# EAGLE design Audio-4 (EAGLE 7.2.0)
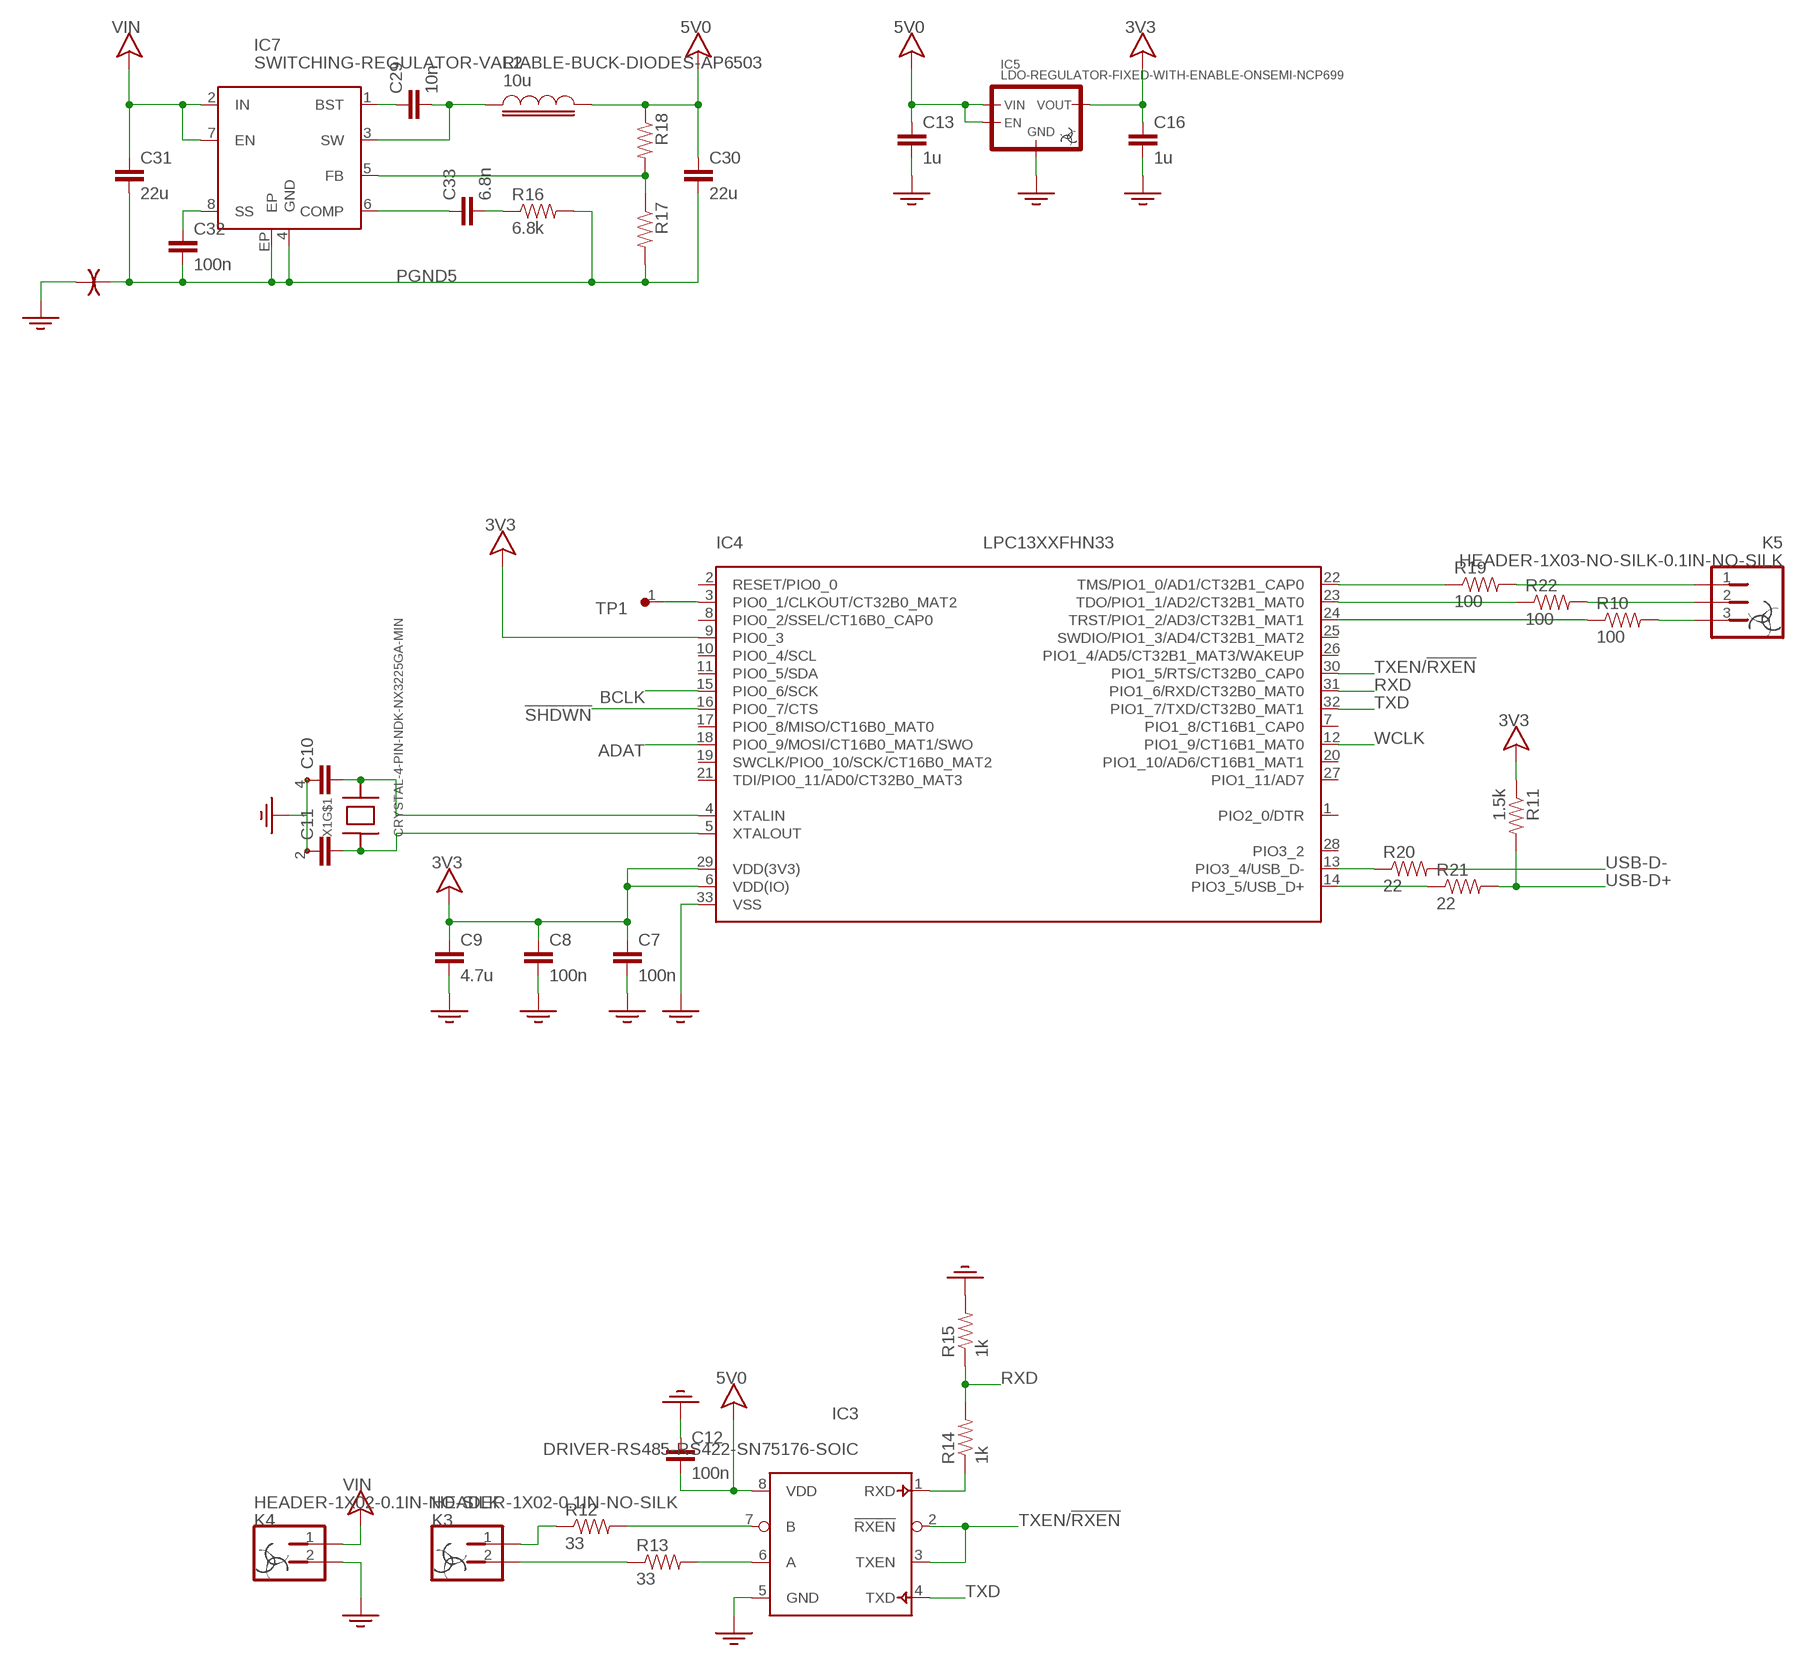
[diagram p0: schematic, sheet 1, part 1 of 2]
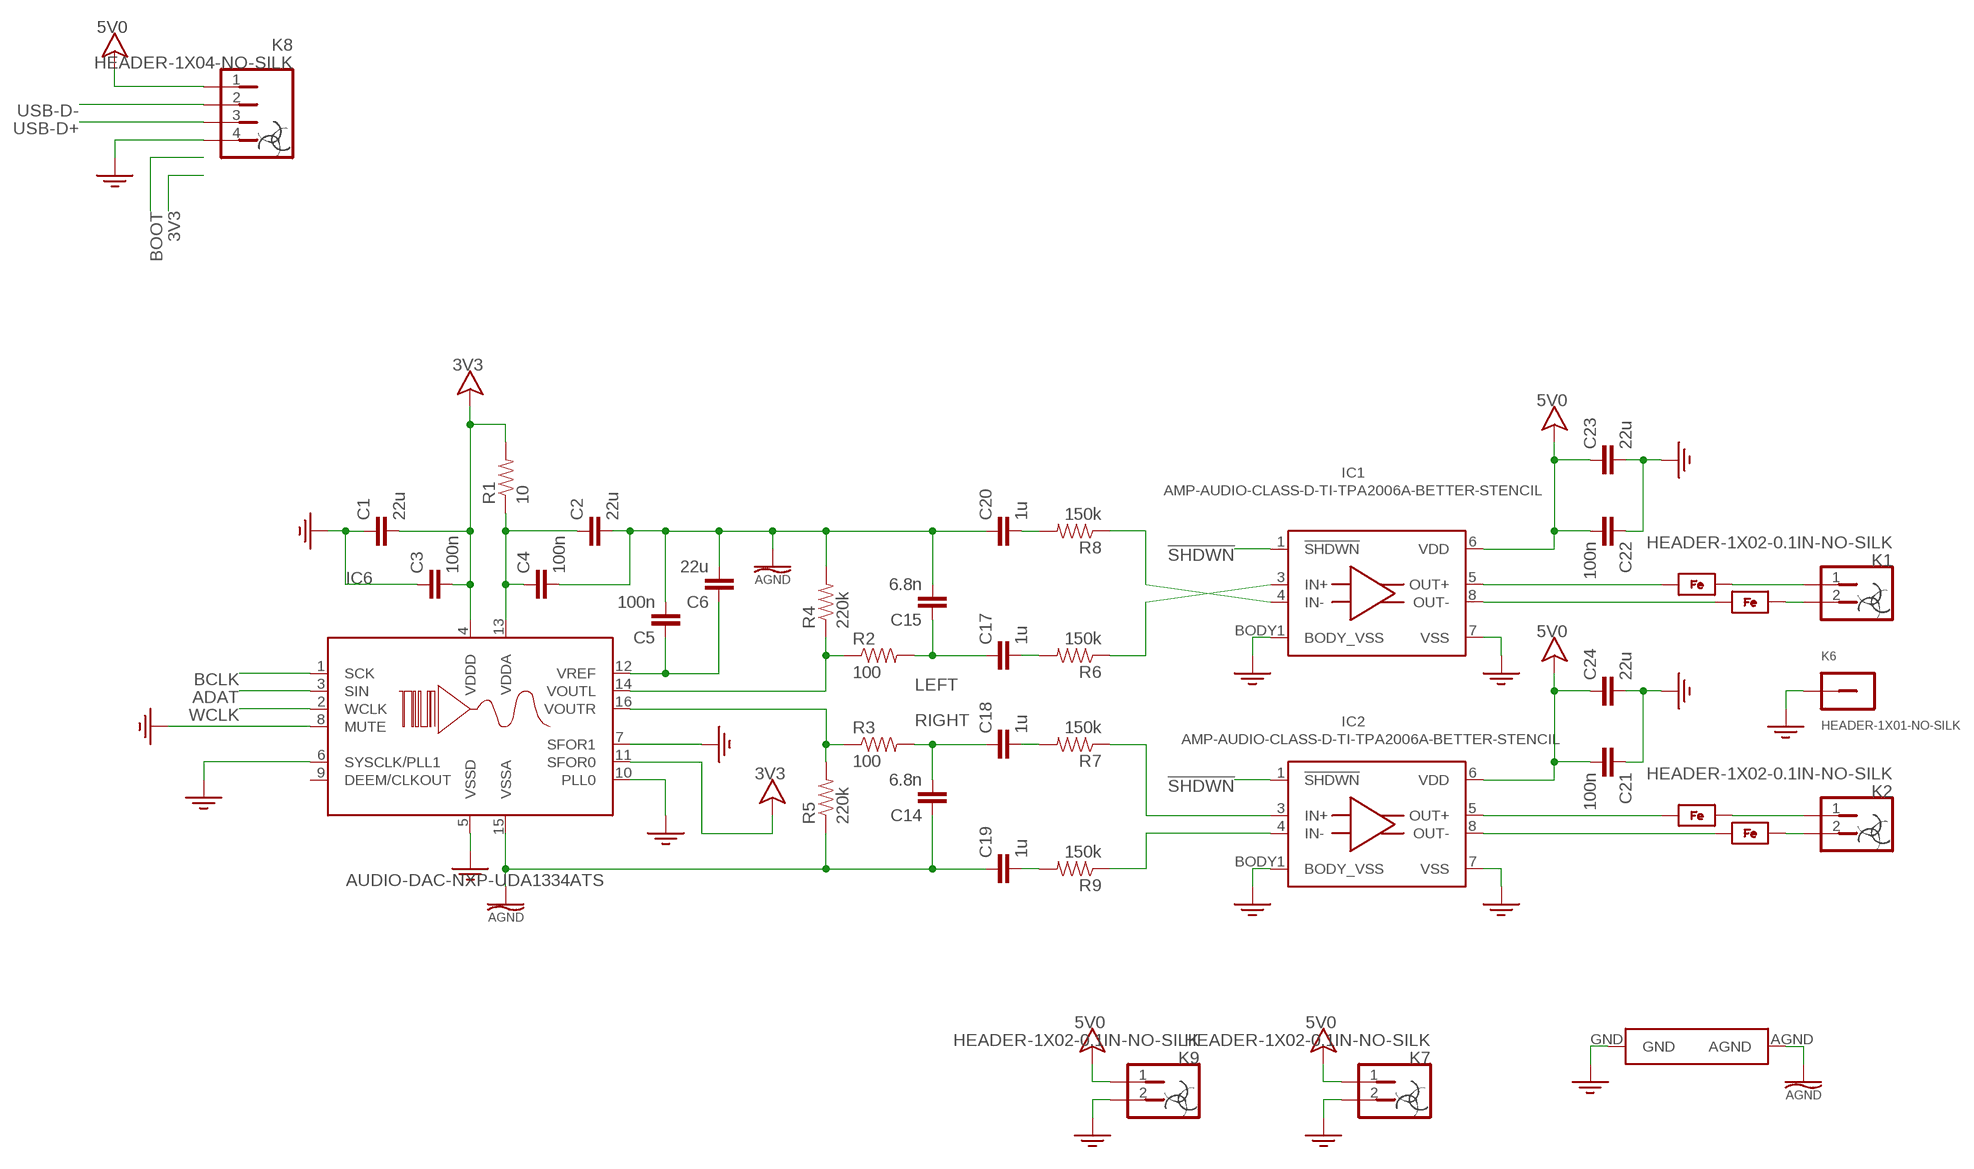
[diagram p1: schematic, sheet 1, part 2 of 2]

## Parts
C1  22u  CAP-1206-MIN  [1206-MIN]
C2  22u  CAP-1206-MIN  [1206-MIN]
C3  100n  CAP-0603-MIN  [0603-MIN]
C4  100n  CAP-0603-MIN  [0603-MIN]
C5  100n  CAP-0603-MIN  [0603-MIN]
C6  22u  CAP-1206-MIN  [1206-MIN]
C7  100n  CAP-0603-MIN  [0603-MIN]
C8  100n  CAP-0603-MIN  [0603-MIN]
C9  4.7u  CAP-0603-MIN  [0603-MIN]
C10  CAP-0603-MIN  [0603-MIN]
C11  CAP-0603-MIN  [0603-MIN]
C12  100n  CAP-0603-MIN  [0603-MIN]
C13  1u  CAP-0603-MIN  [0603-MIN]
C14  6.8n  CAP-0603-MIN  [0603-MIN]
C15  6.8n  CAP-0603-MIN  [0603-MIN]
C16  1u  CAP-0603-MIN  [0603-MIN]
C17  1u  CAP-0603-MIN  [0603-MIN]
C18  1u  CAP-0603-MIN  [0603-MIN]
C19  1u  CAP-0603-MIN  [0603-MIN]
C20  1u  CAP-0603-MIN  [0603-MIN]
C21  100n  CAP-0603-MIN  [0603-MIN]
C22  100n  CAP-0603-MIN  [0603-MIN]
C23  22u  CAP-1206-MIN  [1206-MIN]
C24  22u  CAP-1206-MIN  [1206-MIN]
C29  10n  CAP-0603-MIN  [0603-MIN]
C30  22u  CAP-1206  [1206]
C31  22u  CAP-1206  [1206]
C32  100n  CAP-0603-MIN  [0603-MIN]
C33  6.8n  CAP-0603-MIN  [0603-MIN]
FB1  FERRITE-BEAD-0603-MIN  [0603-MIN]
FB2  FERRITE-BEAD-0603-MIN  [0603-MIN]
FB3  FERRITE-BEAD-0603-MIN  [0603-MIN]
FB4  FERRITE-BEAD-0603-MIN  [0603-MIN]
IC1  AMP-AUDIO-CLASS-D-TI-TPA2006A-BETTER-STENCIL  [QFN8-3X3MM-TI-TPA200X-BETTER-STENCIL]
IC2  AMP-AUDIO-CLASS-D-TI-TPA2006A-BETTER-STENCIL  [QFN8-3X3MM-TI-TPA200X-BETTER-STENCIL]
IC3  DRIVER-RS485-RS422-SN75176-SOIC  [EIAJ-SOIC8]
IC4  LPC13XXFHN33  [HVQFN33-7X7MM]
IC5  LDO-REGULATOR-FIXED-WITH-ENABLE-ONSEMI-NCP699  [SOT23-5]
IC6  AUDIO-DAC-NXP-UDA1334ATS  [TSSOP16]
IC7  SWITCHING-REGULATOR-VARIABLE-BUCK-DIODES-AP6503  [EIAJ-SOIC8-3.9MM-EXPOSED-PAD]
K1  HEADER-1X02-0.1IN-NO-SILK  [HEADER-1X02-NO-SILK]
K2  HEADER-1X02-0.1IN-NO-SILK  [HEADER-1X02-NO-SILK]
K3  HEADER-1X02-0.1IN-NO-SILK  [HEADER-1X02-NO-SILK]
K4  HEADER-1X02-0.1IN-NO-SILK  [HEADER-1X02-NO-SILK]
K5  HEADER-1X03-NO-SILK-0.1IN-NO-SILK  [HEADER-1X03-NO-SILK]
K6  HEADER-1X01-NO-SILK  [HEADER-1X01-NO-SILK]
K7  HEADER-1X02-0.1IN-NO-SILK  [HEADER-1X02-NO-SILK]
K8  HEADER-1X04-NO-SILK  [HEADER-1X04-NO-SILK]
K9  HEADER-1X02-0.1IN-NO-SILK  [HEADER-1X02-NO-SILK]
L2  10u  INDUCTOR-6X6MM  [INDUCTOR-SMD-6X6MM]
R1  10  RESISTOR-0603-MIN  [0603-MIN]
R2  100  RESISTOR-0603-MIN  [0603-MIN]
R3  100  RESISTOR-0603-MIN  [0603-MIN]
R4  220k  RESISTOR-0603-MIN  [0603-MIN]
R5  220k  RESISTOR-0603-MIN  [0603-MIN]
R6  150k  RESISTOR-0603-MIN  [0603-MIN]
R7  150k  RESISTOR-0603-MIN  [0603-MIN]
R8  150k  RESISTOR-0603-MIN  [0603-MIN]
R9  150k  RESISTOR-0603-MIN  [0603-MIN]
R10  100  RESISTOR-0603-MIN  [0603-MIN]
R11  1.5k  RESISTOR-0603-MIN  [0603-MIN]
R12  33  RESISTOR-0805  [0805-MIN]
R13  33  RESISTOR-0805  [0805-MIN]
R14  1k  RESISTOR-0603-MIN  [0603-MIN]
R15  1k  RESISTOR-0603-MIN  [0603-MIN]
R16  6.8k  RESISTOR-0603-MIN  [0603-MIN]
R17  RESISTOR-0603-MIN  [0603-MIN]
R18  RESISTOR-0603-MIN  [0603-MIN]
R19  100  RESISTOR-0603-MIN  [0603-MIN]
R20  22  RESISTOR-0603-MIN  [0603-MIN]
R21  22  RESISTOR-0603-MIN  [0603-MIN]
R22  100  RESISTOR-0603-MIN  [0603-MIN]
TP1  TEST-POINT-0.75MM  [TEST-POINT-0.75MM]
U4  GND-ISOLATOR-0.032"  [GND-ISOLATOR-0.032"]
U$4  GND-AGND-CONNECTION  [GND-AGND-CONNECTION]
X1  CRYSTAL-4-PIN-NDK-NX3225GA-MIN  [CRYSTAL-NDK-NX3225GA-3X2.5MM-MIN]

## Nets
3V3: C1.1 C3.1 C7.2 C8.2 C9.2 C16.2 IC4.6(VDD(IO)) IC4.9(PIO0_3) IC4.29(VDD(3V3)) IC5.5(VOUT) IC6.4(VDDD) IC6.11(SFOR0) R1.2 R11.1 ; supply symbol labelled V
5V0: C12.1 C13.2 C21.1 C22.1 C23.2 C24.2 C30.2 IC1.6(VDD) IC2.6(VDD) IC3.8(VDD) IC5.1(VIN) IC5.3(EN) K7.1 K8.1 K9.1 L2.2 R18.1 ; supply symbol labelled V
5V0FB: IC7.5(FB) R17.1 R18.2
!SHDWN: IC1.1(!SHDWN) IC2.1(!SHDWN) IC4.16(PIO0_7/CTS)
ADAT: IC4.18(PIO0_9/MOSI/CT16B0_MAT1/SWO) IC6.3(SIN)
AGND: C2.1 C4.1 C5.1 C6.1 C14.2 C15.1 C19.2 C20.2 IC6.15(VSSA) R4.2 R5.1 U$4.AGND
BCLK: IC4.15(PIO0_6/SCK) IC6.1(SCK)
GND: C1.2 C3.2 C7.1 C8.1 C9.1 C10.2 C11.2 C12.2 C13.1 C16.1 C21.2 C22.2 C23.1 C24.1 IC1.7(VSS) IC1.BODY1(BODY_VSS) IC2.7(VSS) IC2.BODY1(BODY_VSS) IC3.5(GND) IC4.33(VSS) IC5.2(GND) IC6.5(VSSD) IC6.6(SYSCLK/PLL1) IC6.7(SFOR1) IC6.8(MUTE) IC6.10(PLL0) K4.2 K6.1 K7.2 K8.4 K9.2 R15.2 U4.B U$4.GND X1.2 X1.4
IC1-: IC1.4(IN-) R8.1
IC1SE: IC6.14(VOUTL) R2.1 R4.1
IC2+: IC2.3(IN+) R7.1
IC2-: IC2.4(IN-) R9.1
IC2SE: IC6.16(VOUTR) R3.1 R5.2
LEFT: C15.2 C17.2 R2.2
N$1: IC1.3(IN+) R6.1
N$2: FB1.2 K1.1
N$3: C10.1 IC4.4(XTALIN) X1.3
N$4: C11.1 IC4.5(XTALOUT) X1.1
N$5: IC4.13(PIO3_4/USB_D-) R20.1
N$6: IC4.14(PIO3_5/USB_D+) R21.1
N$7: IC3.7(B) R12.2
N$8: FB2.2 K1.2
N$9: FB3.2 K2.1
N$10: C17.1 R6.2
N$11: C18.1 R7.2
N$12: IC3.6(A) R13.2
N$13: C29.1 IC7.3(SW) L2.1
N$14: IC3.1(RXD) R14.1
N$15: C29.2 IC7.1(BST)
N$16: C33.2 IC7.6(COMP)
N$17: C33.1 R16.1
N$18: K3.2 R13.1
N$19: K3.1 R12.1
N$20: C32.2 IC7.8(SS)
N$21: FB4.2 K2.2
N$22: K5.2 R22.2
N$23: IC4.24(TRST/PIO1_2/AD3/CT32B1_MAT1) R10.1
N$24: C2.2 C4.2 IC6.13(VDDA) R1.1
N$25: IC4.23(TDO/PIO1_1/AD2/CT32B1_MAT0) R22.1
N$26: K5.3 R10.2
N$27: IC4.22(TMS/PIO1_0/AD1/CT32B1_CAP0) R19.1
N$29: IC4.3(PIO0_1/CLKOUT/CT32B0_MAT2) TP1.1
N$33: K5.1 R19.2
N$40: C19.1 R9.2
N$41: C20.1 R8.2
N$43: FB1.1 IC1.5(OUT+)
N$44: FB2.1 IC1.8(OUT-)
N$45: FB3.1 IC2.5(OUT+)
N$46: FB4.1 IC2.8(OUT-)
PGND5: C30.1 C31.1 C32.1 IC7.4(GND) IC7.EP R16.2 R17.2 U4.A
RIGHT: C14.1 C18.2 R3.2
RXD: IC4.31(PIO1_6/RXD/CT32B0_MAT0) R14.2 R15.1
TXD: IC3.4(TXD) IC4.32(PIO1_7/TXD/CT32B0_MAT1)
TXEN/!RXEN: IC3.2(!RXEN) IC3.3(TXEN) IC4.30(PIO1_5/RTS/CT32B0_CAP0)
USB-D+: K8.3 R11.2 R21.2
USB-D-: K8.2 R20.2
VIN: C31.2 IC7.2(IN) IC7.7(EN) K4.1 ; supply symbol labelled V
VREF: C5.2 C6.2 IC6.12(VREF)
WCLK: IC4.12(PIO1_9/CT16B1_MAT0) IC6.2(WCLK)
Unconnected: IC4.1(PIO2_0/DTR) IC4.2(RESET/PIO0_0) IC4.7(PIO1_8/CT16B1_CAP0) IC4.8(PIO0_2/SSEL/CT16B0_CAP0) IC4.10(PIO0_4/SCL) IC4.11(PIO0_5/SDA) IC4.17(PIO0_8/MISO/CT16B0_MAT0) IC4.19(SWCLK/PIO0_10/SCK/CT16B0_MAT2) IC4.20(PIO1_10/AD6/CT16B1_MAT1) IC4.21(TDI/PIO0_11/AD0/CT32B0_MAT3) IC4.25(SWDIO/PIO1_3/AD4/CT32B1_MAT2) IC4.26(PIO1_4/AD5/CT32B1_MAT3/WAKEUP) IC4.27(PIO1_11/AD7) IC4.28(PIO3_2) IC6.9(DEEM/CLKOUT)

## Library data of the parts
C1-C24 C29-C33 = Outbreak:CAP
FB1-FB4 = Outbreak:FERRITE-BEAD
IC1 IC2 = Outbreak:AMP-AUDIO-CLASS-D-TI-TPA2006A
IC3 = Outbreak:DRIVER-RS485-RS422-SN75176
IC4 = Outbreak:LPC13XXFHN33: LPC1313 72 MHz 32-bit ARM Cortex-M3 based microcontroller featuring a high level of integration and low power consumption. 32 kB Flash, 8 kB SRAM MarcVl - Datasheet available on www.nxp.com
IC5 = Outbreak:LDO-REGULATOR-FIXED-WITH-ENABLE: Low Drop-Out (LDO) Volt Regulator with enable pin (active at logic high.)
IC6 = Outbreak:AUDIO-DAC-NXP-UDA1334ATS
IC7 = Outbreak:SWITCHING-REGULATOR-VARIABLE-BUCK-DIODES-AP6503
K1-K4 K7 K9 = Outbreak:HEADER-1X02
K5 = Outbreak:HEADER-1X03-NO-SILK
K6 = Outbreak:HEADER-1X01
K8 = Outbreak:HEADER-1X04-NO-SILK
L2 = Outbreak:INDUCTOR
R1-R22 = Outbreak:RESISTOR: Resistor Basic schematic elements and footprints for 0603, 1206, and PTH resistors.
TP1 = Outbreak:TEST-POINT
U4 = Outbreak:GND-ISOLATOR
U$4 = Outbreak:GND-AGND-CONNECTION
X1 = Outbreak:CRYSTAL-4-PIN

## Board
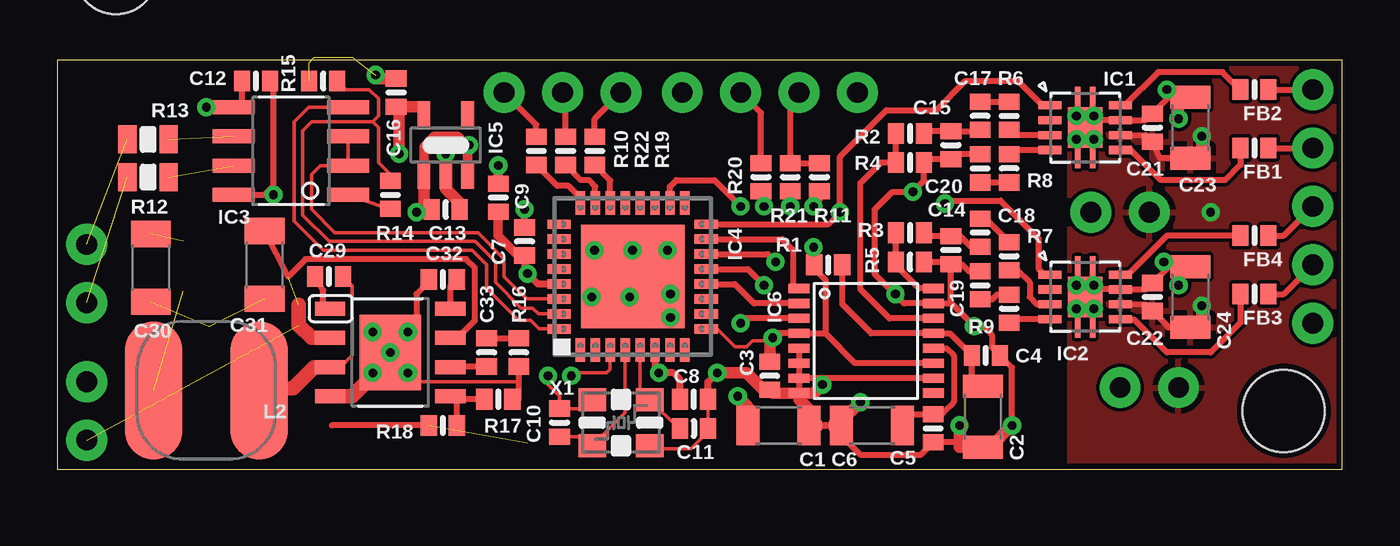
[diagram p2: board, top side]
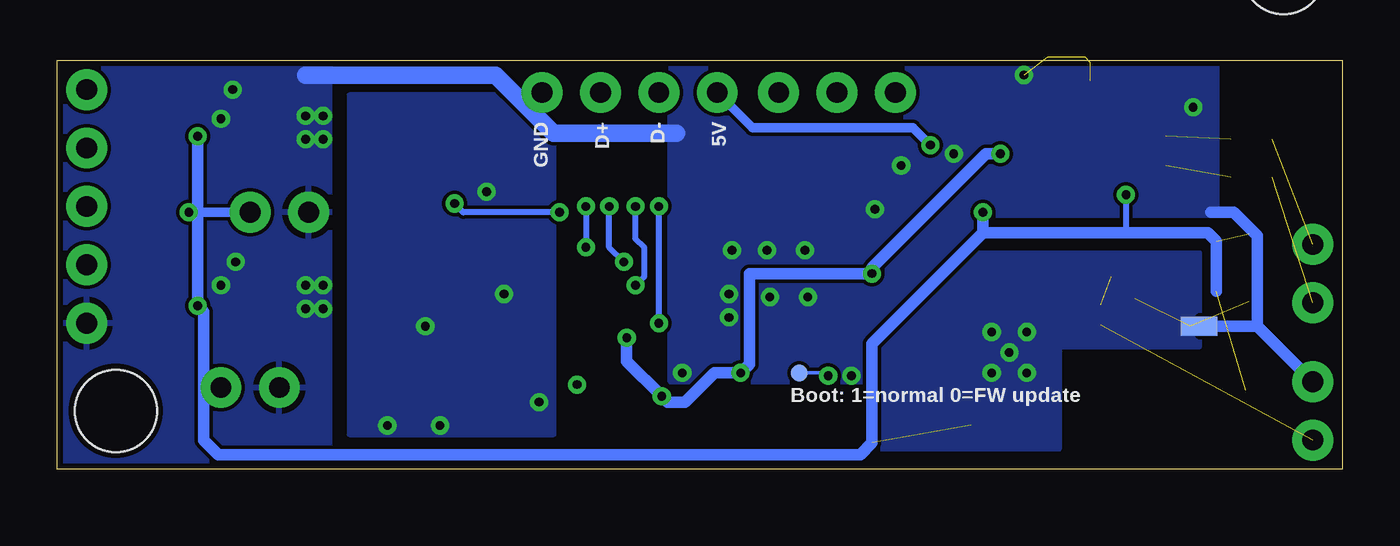
[diagram p3: board, bottom side, seen from below]

Size 55.88 x 17.78 mm. Coordinates in mm from the lower left corner, seen from the top.
Outline: 0,0 55.88,0 55.88,17.78 0,17.78 0,0
Copper layers (1*16): Top 0.035mm / dielectric 1.5mm / Bottom 0.035mm
Design rules "default *": minimum track width 6mil, minimum drill 15mil, track to track 6mil, track to pad 6mil, pad to pad 6mil, via to via 6mil, smd to smd 6mil, copper to edge 10mil, drill to drill 8mil, minimum pad ring 10mil, minimum via ring 8mil, stop-mask expansion 4mil, vias tented up to drill 20mil, thermal gap 10mil
Holes 3.58 mm at 2.54,21.59 53.34,2.54

### Footprints (pad centres in the part's own frame; a part is rotated, then mirrored left to right if it is on the bottom)
1206-MIN = smd 1 x 1.727: 1 -1.323,0; 2 1.323,0
0603-MIN = smd 0.7 x 0.9: 1 -0.61,0; 2 0.61,0
1206 = smd 1.143 x 1.727: 1 -1.473,0; 2 1.473,0
QFN8-3X3MM-TI-TPA200X-BETTER-STENCIL = smd 0.35 x 1: 1 0.975,1.525; 2 0.325,1.525; 3 -0.325,1.525; 4 -0.975,1.525; 5 -0.975,-1.525; 6 -0.325,-1.525; 7 0.325,-1.525; 8 0.975,-1.525 | smd 1.75 x 1.5: BODY1 0,0 | smd 0.9 x 0.23: BODY2 -1.325,0.325; BODY3 -1.325,-0.325; BODY4 1.325,-0.325; BODY5 1.325,0.325
EIAJ-SOIC8 = smd 1.829 x 0.61: 1 -2.491,1.905; 2 -2.491,0.635; 3 -2.491,-0.635; 4 -2.491,-1.905; 5 2.491,-1.905; 6 2.491,-0.635; 7 2.491,0.635; 8 2.491,1.905
HVQFN33-7X7MM = smd 1.013 x 0.406: 1 -3.2,2.275; 2 -3.2,1.625; 3 -3.2,0.975; 4 -3.2,0.325; 5 -3.2,-0.325; 6 -3.2,-0.975; 7 -3.2,-1.625; 8 -3.2,-2.275; 17 3.2,-2.275; 18 3.2,-1.625; 19 3.2,-0.975; 20 3.2,-0.325; 21 3.2,0.325; 22 3.2,0.975; 23 3.2,1.625; 24 3.2,2.275 | smd 0.406 x 1.013: 9 -2.275,-3.2; 10 -1.625,-3.2; 11 -0.975,-3.2; 12 -0.325,-3.2; 13 0.325,-3.2; 14 0.975,-3.2; 15 1.625,-3.2; 16 2.275,-3.2; 25 2.275,3.2; 26 1.625,3.2; 27 0.975,3.2; 28 0.325,3.2; 29 -0.325,3.2; 30 -0.975,3.2; 31 -1.625,3.2; 32 -2.275,3.2 | smd 4.5 x 4.5: 33 0,0
SOT23-5 = smd 0.55 x 1.2: 1 0.95,1.3; 2 0,1.3; 3 -0.95,1.3; 4 -0.95,-1.3; 5 0.95,-1.3
TSSOP16 = smd 0.4 x 0.9: 1 2.275,2.925; 2 1.625,2.925; 3 0.975,2.925; 4 0.325,2.925; 5 -0.325,2.925; 6 -0.975,2.925; 7 -1.625,2.925; 8 -2.275,2.925; 9 -2.275,-2.925; 10 -1.625,-2.925; 11 -0.975,-2.925; 12 -0.325,-2.925; 13 0.325,-2.925; 14 0.975,-2.925; 15 1.625,-2.925; 16 2.275,-2.925
EIAJ-SOIC8-3.9MM-EXPOSED-PAD = smd 1.321 x 0.61: 1 -2.618,1.905; 2 -2.618,0.635; 3 -2.618,-0.635; 4 -2.618,-1.905; 5 2.618,-1.905; 6 2.618,-0.635; 7 2.618,0.635; 8 2.618,1.905 | smd 2.66 x 3.3: EP 0,0
HEADER-1X02-NO-SILK = drill 0.9 pad 1.778: 1 -1.27,0; 2 1.27,0
HEADER-1X03-NO-SILK = drill 0.9 pad 1.778: 1 -2.54,0; 2 0,0; 3 2.54,0
HEADER-1X01-NO-SILK = drill 0.9 pad 1.778: 1 0,0
HEADER-1X04-NO-SILK = drill 0.9 pad 1.778: 1 0,0; 2 2.54,0; 3 5.08,0; 4 7.62,0
INDUCTOR-SMD-6X6MM = smd 2.5 x 6: 1 -2.3,0; 2 2.3,0
0805-MIN = smd 0.8 x 1.2: 1 -0.9,0; 2 0.9,0
TEST-POINT-0.75MM = smd 0.75 x 0.75: 1 0,0
GND-ISOLATOR-0.032" = smd 0.813 x 0.813: A -0.381,0; B 0.381,0
GND-AGND-CONNECTION = smd 0.406 x 0.406: AGND 0.356,0; GND -0.356,0
CRYSTAL-NDK-NX3225GA-3X2.5MM-MIN = smd 1.2 x 1: 1 -1.25,-1; 2 1.25,-1; 3 1.25,1; 4 -1.25,1

### Placement (x,y rotation side)
C1  31.37,1.91 0 top
C2  40.26,2.29 90 top
C3  30.99,4.06 270 top
C4  40.39,4.95 180 top
C5  38.1,1.78 90 top
C6  35.43,1.91 0 top
C7  20.32,9.91 270 top
C8  27.69,3.05 180 top
C9  19.18,11.81 270 top
C10  21.84,2.03 90 top
C11  27.69,1.78 0 top
C12  8.64,16.89 180 top
C13  16.89,11.3 180 top
C14  38.86,9.53 270 top
C15  38.86,14.1 90 top
C16  14.73,16.38 270 top
C17  40.13,15.37 270 top
C18  40.13,10.29 270 top
C19  40.13,8 90 top
C20  40.13,13.08 90 top
C21  47.62,14.86 90 top
C22  47.62,7.49 90 top
C23  49.28,14.86 270 top
C24  49.28,7.49 270 top
C29  11.81,8.38 180 top
C30  4.06,8.76 90 top
C31  9.02,8.89 90 top
C32  16.76,8.26 0 top
C33  18.67,5.08 270 top
FB1  52.07,13.97 0 top
FB2  52.07,16.51 0 top
FB3  52.07,7.62 0 top
FB4  52.07,10.16 0 top
IC1  44.7,14.86 90 top
IC2  44.7,7.49 90 top
IC3  10.16,13.84 180 top
IC4  25.02,8.38 90 top
IC5  16.89,14.1 180 top
IC6  35.18,5.59 90 top
IC7  14.48,5.08 0 top
K1  54.61,15.24 90 top
K2  54.61,10.16 90 top
K3  1.27,8.51 90 top
K4  1.27,2.54 90 top
K5  21.97,16.38 180 top
K6  54.61,6.35 0 top
K7  46.23,11.18 180 top
K8  27.18,16.38 0 top
K9  47.5,3.56 180 top
L2  6.48,3.43 180 top
R1  33.53,8.89 180 top
R2  37.08,14.61 0 top
R3  37.08,10.29 0 top
R4  37.08,13.34 0 top
R5  37.08,9.02 180 top
R6  41.4,15.37 90 top
R7  41.4,9.27 90 top
R8  41.4,13.08 270 top
R9  41.4,6.99 90 top
R10  20.83,13.84 90 top
R11  33.15,12.7 90 top
R12  3.94,12.7 0 top
R13  3.94,14.35 0 top
R14  14.48,11.94 90 top
R15  11.56,16.89 180 top
R16  20.07,5.08 270 top
R17  19.18,3.05 0 top
R18  16.76,1.91 0 top
R19  23.37,13.84 90 top
R20  30.61,12.7 90 top
R21  31.88,12.7 90 top
R22  22.1,13.84 90 top
TP1  23.62,4.19 0 bottom
U4  6.22,6.22 0 bottom
U$4  33.4,1.91 0 top
X1  24.51,2.03 180 top

### Tracks (layer width: path | path; a pad name or v marks a point on that pad's centre or on a via)
3V3  (via drill 0.38)
  Top 0.152: IC4.9 28.69,6.11 29.46,5.33 29.97,5.33 30.23,5.59 30.99,5.59
  Top 0.254: 15.9,15.44 IC5.5 | 33.43,5.91 IC6.4 31.37,5.91 v31.11,5.71 | 33.43,5.91 33.43,8.23 32.89,8.76 R1.2 32.92,9.63 v32.89,9.65 | IC6.11 34.7,4.61 33.43,5.88 33.43,5.91 | R11.1 33.15,11.68 v32.89,11.43
  Top 0.305: IC4.29 20.9,8.06 v20.45,8.51 20.32,8.64 C7.2 | IC4.6 25.99,4.36 v26.16,4.19 26.8,4.19 27.08,3.91 C8.2
  Top 0.406: C7.2 20.04,9.3 19.18,10.16 C9.2
  Top 0.508: 15.94,15.05 IC5.5 15.94,15.77 C16.2 14.86,15.65 v14.86,13.72 | C1.1 30.05,2.72 v29.59,3.17 | C3.1 30.99,5.59 v31.11,5.71
  Bottom 0.152: 25.78,5.59 25.78,5.84
  Bottom 0.254: v32.89,11.43 v32.89,9.65
  Bottom 0.508: v14.86,13.72 15.49,13.72 20.45,8.76 v20.45,8.51 25.78,8.51 25.78,5.84 25.78,4.57 v26.16,4.19 27.3,4.19 28.57,2.92 29.34,2.92 v29.59,3.17 31.11,4.7 v31.11,5.71
5V0  (via drill 0.38)  (3 unrouted)
  Top 0.254: R18.1 11.94,1.91 | IC3.8 9.02,11.94 | 9.02,11.94 9.4,12.32 9.4,16.87 C12.1 | 9.02,11.94 v9.4,11.94 | IC2.6 47.34,7.17 C22.1 48.34,6.17 C24.2 | IC1.6 47.34,14.53 C21.1 47.96,13.54 C23.2 | v17.9,14.1 v17.91,14.1
  Top 0.406: IC5.1 15.94,14.04 16.38,14.48 17.4,14.48 17.84,14.04 | IC5.3 17.84,14.04 | 17.84,14.04 v17.9,14.1
  Top 0.508: v15.62,11.18 15.75,11.3 C13.2 15.94,11.64 IC5.1 | C24.2 49.78,6.17 v49.78,7.11 | C23.2 49.78,13.54 v49.78,14.48
  Bottom 0.254: v9.4,11.94 9.4,10.29 | v50.16,11.18 49.78,11.18
  Bottom 0.406: v17.91,14.1 18.67,14.86 25.65,14.86 K8.1 | 49.78,11.18 K7.1 | K9.1 49.53,3.56
  Bottom 0.508: 5.46,7.75 5.46,9.91 5.84,10.29 9.4,10.29 15.62,10.29 | 15.62,10.29 v15.62,11.18 | 15.62,10.29 20.45,5.46 20.45,1.14 20.95,0.64 48.9,0.64 49.53,1.27 49.53,3.56 49.53,6.86 v49.78,7.11 49.78,11.18 v49.78,14.48
  pour Top: 44.07,17.78 55.88,17.78 55.88,0 44.07,0
5V0FB
  Top 0.152: IC7.5 17.37,2.9 17.52,3.05
  Top 0.254: R18.2 17.37,2.9 | R17.1 17.52,3.05
!SHDWN  (via drill 0.38)
  Top 0.254: IC4.16 33.53,10.66 v34.04,11.18 34.04,13.59 36.07,15.62 38.23,15.62 39.5,16.89 41.78,16.89 42.84,15.83 IC1.1 | v38.61,11.56 38.61,11.68 41.02,11.68 42.67,10.03 42.67,8.72 42.93,8.47 | IC2.1 42.93,8.47 | 42.93,8.47 42.8,8.47
  Bottom 0.254: v34.04,11.18 38.23,11.18 v38.61,11.56
ADAT  (via drill 0.38)
  Top 0.254: IC6.3 29.93,6.56 v29.72,6.35 | 29.57,11.58 v29.72,11.43 28.57,12.57 26.92,12.57 26.64,12.29 IC4.18
  Bottom 0.254: v29.72,6.35 v29.72,11.43
AGND  (via drill 0.38)
  Top 0.254: 38.86,7.21 IC6.15 36.83,7.21 35.56,8.48 35.56,11.3 36.32,12.06 v37.21,12.06 37.69,12.55 R4.2 37.69,13.49 C15.1 38.86,13.69 C20.2 | 38.86,7.21 C14.2 | R5.1 38.86,9.02 C14.2 | C19.2 39.65,8.61 39.34,8.91 C14.2 | 38.86,7.21 38.89,7.21 v39.88,6.22 40.26,6.22 40.64,5.84 40.64,5.31 C4.1 41.53,4.42 v41.53,1.91 | 40.59,0.96 C2.1 40.26,1.17 C5.1 37.57,0.64 34.92,0.64 34.11,1.45 C6.1 U$4.AGND
  Top 0.508: 40.59,0.96 v41.53,1.91 | C6.1 34.11,2.11 v34.92,2.92 | C2.1 39.24,0.96 v39.24,1.91
  other vias: 36.45,7.62
  pour Bottom: 34.29,16.26 43.18,16.26 43.18,1.52 34.29,1.52
BCLK
  Top 0.254: IC4.15 31.52,10.01 32,9.53 32,7.86 IC6.1
GND  (via drill 0.38)  (4 unrouted)
  Top 0.152: X1.2 23,2.64 C10.2 21.84,3.17 21.34,3.68 v21.34,4.06 | X1.4 25.9,0.89 27.56,0.89 28.3,1.63 C11.2 C8.1
  Top 0.254: C12.2 8.03,15.75 IC3.5 6.6,15.67 v6.48,15.75 | IC6.10 IC6.7 | IC6.5 IC6.6 IC6.7 | IC6.7 IC6.8 | IC1.BODY1 44.7,15.18 IC1.7 47.34,15.18 C21.2 48.34,16.18 48.77,16.18 | IC2.BODY1 44.7,7.82 IC2.7 47.34,7.82 C22.2 48.34,8.82 48.77,8.82 | U$4.GND C1.2
  Top 0.305: C8.1 28.3,3.79 v28.7,4.19 | C7.1 v20.32,11.3
  Top 0.406: C9.1 v19.18,13.21
  Top 0.508: v16.89,13.72 IC5.2 16.89,12.19 17.5,11.58 C13.1 | 25.02,10.03 v25.02,9.53 IC4.33 25.02,7.49 v24.89,7.49 | IC6.8 32.25,3.05 32.69,2.61 C1.2 | IC6.8 31.13,3.31 C3.2 30.71,3.45 29.97,4.19 v28.7,4.19 | C23.1 48.77,16.18 v48.77,15.24 | C24.1 48.77,8.82 v48.77,8 | IC6.8 32.9,3.31 v33.27,3.68 | C16.1 13.95,16.99 v13.84,17.14
  Bottom 0.254: K8.4 34.92,16.38 35.5,15.81
  Bottom 0.508: U4.B 3.68,6.22 | 3.68,6.22 K4.2 | 3.68,6.22 3.68,10.16 4.7,11.18 5.71,11.18
  Bottom 0.762: 45.09,17.14 36.83,17.14 35.5,15.81 34.29,14.61 28.96,14.61
  other vias: 23.24,7.49 23.37,9.53 26.54,9.53 26.67,6.6 26.67,7.62 44.32,15.37 45.09,15.37 45.09,14.35 44.32,14.35 44.32,8 45.09,8 45.09,6.99 44.32,6.99 48.13,9.02 48.26,16.51
  pour Bottom: 5.46,17.78 5.46,11.05 15.62,11.05 20.7,5.97 20.7,3.81 29.21,3.81 29.21,17.78
  pour Bottom: 55.88,17.78 44.07,17.78 44.07,0 55.88,0
IC1-
  Top 0.254: IC1.4 41.4,13.88 R8.1
IC1SE
  Top 0.254: IC6.14 36.2,6.56 34.92,7.83 34.92,12.45 35.81,13.34 R4.1 R2.1
IC2+
  Top 0.254: R7.1 41.76,8.66 42.29,8.13 42.29,7.49 42.62,7.17 IC2.3
IC2-
  Top 0.254: IC2.4 41.4,6.52 R9.1
IC2SE
  Top 0.254: R3.1 R5.2 36.47,8.87 37.48,7.86 IC6.16
LEFT
  Top 0.254: C17.2 40.13,14.71 C15.2 37.69,14.71 R2.2
N$1
  Top 0.254: IC1.3 41.4,14.53 R6.1
N$2
  Top 0.254: FB1.2 K1.1
N$3
  Top 0.152: IC4.4 24.69,2.46 X1.3 22.74,1.42 C10.1
N$4
  Top 0.152: IC4.5 25.34,3.32 X1.1 27.02,1.78 C11.1
N$5  (via drill 0.38)
  Top 0.254: IC4.13 30.03,8.71 v30.73,8 | R20.1 30.73,11.96 v30.73,11.43
  Bottom 0.254: v30.73,8 30.35,8.38 30.35,9.65 30.73,10.03 v30.73,11.43
N$6  (via drill 0.38)
  Top 0.254: IC4.14 30.9,9.36 v31.24,9.02 | R21.1 v31.88,11.43
  Bottom 0.254: v31.24,9.02 31.88,9.65 v31.88,11.43
N$7  (1 unrouted)
N$8
  Top 0.254: FB2.2 K1.2
N$9
  Top 0.254: FB3.2 53.34,7.62 K2.1
N$10
  Top 0.254: C17.1 R6.2
N$11
  Top 0.254: C18.1 40.39,10.9 R7.2
N$12  (1 unrouted)
N$13
  Top 0.152: 12.32,4.45 12.83,4.95 12.83,7.98 C29.1
  Top 0.203: IC7.3 12.32,4.45
  Top 0.635: IC7.3 11.18,4.45 10.26,3.53 L2.1
N$14
  Top 0.152: IC3.1 14.45,11.3 R14.1
N$15
  Top 0.254: IC7.1 11.56,6.99 11.56,7.77 C29.2
N$16
  Top 0.152: IC7.6 17.1,4.47
  Top 0.254: 17.1,4.47 C33.2
N$17
  Top 0.254: C33.1 R16.1
N$18  (1 unrouted)
N$19  (1 unrouted)
N$20
  Top 0.254: IC7.8 17.1,7.98 C32.2
N$21
  Top 0.254: FB4.2 53.34,10.16 K2.2
N$22
  Top 0.254: R22.2 22.1,16.26 K5.2
N$23
  Top 0.254: IC4.24 22.74,11.8 22.23,12.32 21.74,12.32 R10.1
N$24
  Top 0.254: C2.2 39.78,3.61 C4.2 38.82,5.91 IC6.13 35.41,5.91 34.14,7.18 R1.1
N$25
  Top 0.254: IC4.23 23.39,12.29 23.11,12.57 22.76,12.57 R22.1
N$26
  Top 0.254: R10.2 20.83,14.99 K5.3
N$27
  Top 0.254: IC4.22 24.04,12.56 R19.1
N$29  (via drill 0.38)
  Top 0.152: IC4.3 24.04,4.36 23.88,4.19 22.48,4.19 v22.35,4.06
  Bottom 0.152: v22.35,4.06 22.48,4.19 TP1.1
N$33
  Top 0.254: R19.2 23.37,15.24 K5.1
N$40
  Top 0.254: C19.1 40.66,7.39 40.87,7.59 R9.2
N$41
  Top 0.254: C20.1 R8.2
N$43
  Top 0.254: FB1.1 51.46,13.23 50.8,12.57 48.01,12.57 46.7,13.88 IC1.5
N$44
  Top 0.254: FB2.1 51.46,16.48 50.67,17.27 47.88,17.27 46.44,15.83 IC1.8
N$45
  Top 0.254: IC2.5 46.82,6.52 48.26,5.08 50.16,5.08 51.46,6.38 FB3.1
N$46
  Top 0.254: FB4.1 48.26,10.16 46.57,8.47 IC2.8
PGND5  (via drill 0.38)  (2 unrouted)
  Top 0.152: R16.2 20.07,3.81 14.48,3.81 14.48,4.83 | C32.1 16.15,8.15 | 15.62,6.22 IC7.EP
  Top 0.254: R16.2 20.07,3.05 R17.2 | 16.15,8.15 15.62,7.62 15.62,6.22
  Top 0.635: IC7.4 12.83,3.17 14.48,4.83 IC7.EP
  other vias: 14.48,5.08 13.72,5.97 15.24,5.97 13.72,4.19 15.24,4.19
  pour Bottom: 6.22,9.4 6.22,5.33 12.32,5.33 12.32,0.89 20.07,0.89 20.07,9.4
RIGHT
  Top 0.254: R3.2 37.69,10.13 C14.1 39.27,10.13 39.73,9.68 C18.2
RXD
  Top 0.152: 13.72,15.11 11.05,15.11 10.67,14.73 10.67,11.05 11.81,9.91 18.16,9.91 19.05,9.02 19.05,8.13 20.17,7.01 20.68,7.01 20.93,6.76 IC4.31 | 13.72,15.11 13.97,15.37 13.97,16.1 13.56,16.51 12.55,16.51 R15.1 | R14.2 14.48,12.83 13.97,13.34 13.97,14.86 13.72,15.11
TXD
  Top 0.152: IC4.32 20.94,6.11 20.57,6.48 20.07,6.48 18.67,7.87 18.67,8.89 18.03,9.53 11.56,9.53 10.29,10.79 10.29,15.11 10.92,15.75 IC3.4
TXEN/!RXEN
  Top 0.152: IC4.30 20.41,7.41 19.43,8.38 19.43,9.14 18.29,10.29 12.06,10.29 11.05,11.3 11.05,12.83 11.43,13.21 IC3.2 IC3.3
USB-D+
  Top 0.254: R11.2 R21.2 31.88,16 K8.3
USB-D-
  Top 0.254: R20.2 30.61,15.49 K8.2
VIN  (2 unrouted)
  Top 0.152: IC7.7 17.4,5.71
  Top 0.254: 17.4,5.71 18.16,6.48 18.16,8.76 17.78,9.14 10.79,9.14 10.03,8.38 C31.2
  Top 0.635: IC7.2 11.05,5.71 10.49,6.27 10.49,7.16
VREF
  Top 0.254: C6.2 36.76,2.39 C5.2 38.46,2.39 38.48,2.41 38.54,2.48 38.99,2.92 38.99,4.95 38.68,5.26 IC6.12
WCLK
  Top 0.254: IC4.12 29.46,8.06 30.31,7.21 IC6.2

### Text on the board
bPlace: 5V | D- | D+ | GND | Boot: 1=normal 0=FW update